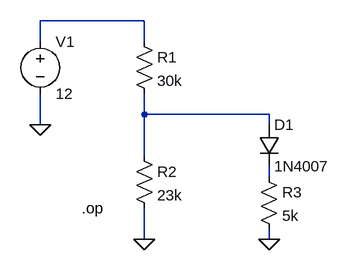
[diagram p0: schematic Diodo 3-29.asc]
Diodo 3-29.asc, the LTspice schematic file:
Version 4
SHEET 1 880 680
WIRE 160 -16 0 -16
WIRE 0 16 0 -16
WIRE 160 16 160 -16
WIRE 160 128 160 96
WIRE 352 128 160 128
WIRE 0 144 0 96
WIRE 352 144 352 128
WIRE 160 192 160 128
WIRE 352 224 352 208
WIRE 160 320 160 272
WIRE 352 320 352 304
FLAG 0 144 0
FLAG 352 320 0
FLAG 160 320 0
SYMBOL voltage 0 0 R0
SYMATTR InstName V1
SYMATTR Value 12
SYMBOL res 144 0 R0
SYMATTR InstName R1
SYMATTR Value 30k
SYMBOL res 144 176 R0
SYMATTR InstName R2
SYMATTR Value 23k
SYMBOL res 336 208 R0
SYMATTR InstName R3
SYMATTR Value 5k
SYMBOL diode 336 144 R0
SYMATTR InstName D1
SYMATTR Value 1N4007
TEXT 64 272 Left 2 !.op

The netlist it stands for:
* Diodo 3-29.asc
V1 N001 0 12
R1 N001 N002 30k
R2 N002 0 23k
R3 N003 0 5k
D1 N002 N003 1N4007
.model D D
.lib standard.dio
.op
.backanno
.end